# EAGLE design LAB-PLR5010D (EAGLE 6.6.0)
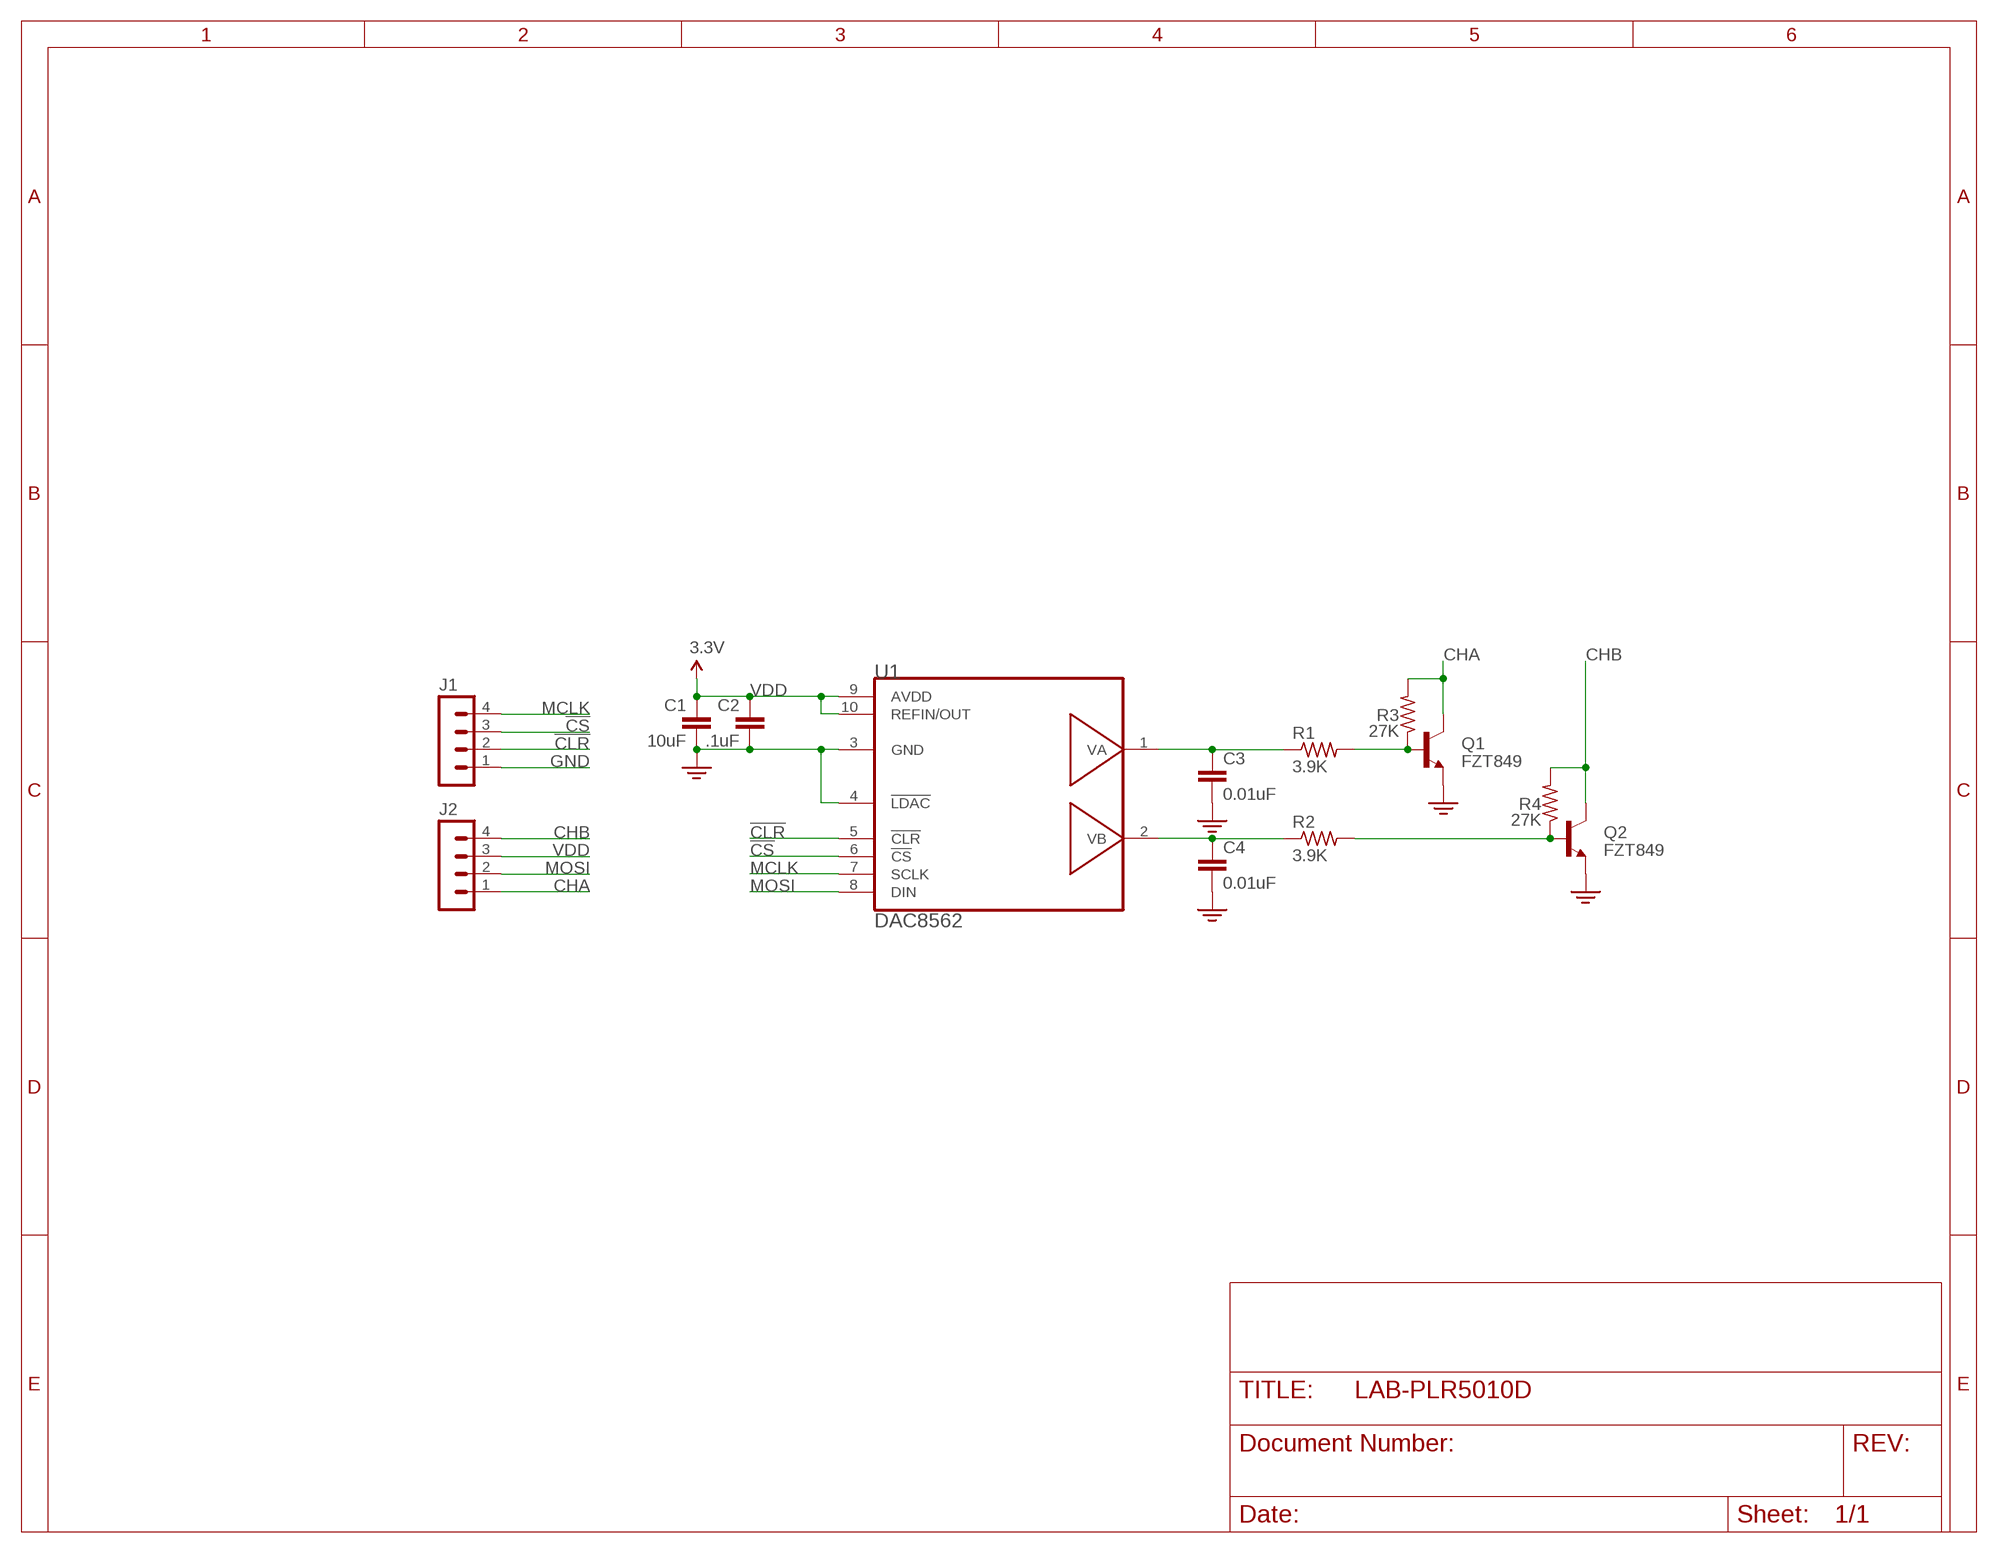
[diagram p0: schematic, sheet 1]

## Parts
C1  10uF  1NF/1000PF-50V-10%(0603)  [0603-CAP]
C2  .1uF  1NF/1000PF-50V-10%(0603)  [0603-CAP]
C3  0.01uF  1NF/1000PF-50V-10%(0603)  [0603-CAP]
C4  0.01uF  1NF/1000PF-50V-10%(0603)  [0603-CAP]
J1  MA04-1  [MA04-1]
J2  MA04-1  [MA04-1]
Q1  FZT849  [SOT223]
Q2  FZT849  [SOT223]
R1  3.9K  R-US_R0603  [R0603]
R2  3.9K  R-US_R0603  [R0603]
R3  27K  R-US_R0603  [R0603]
R4  27K  R-US_R0603  [R0603]
U1  DAC8562  [MSOP10]

## Nets
!CLR: J1.2 U1.5(!CLR)
!CS: J1.3 U1.6(!CS)
CHA: J2.1 Q1.2(C) Q1.4(C) R3.2
CHB: J2.4 Q2.2(C) Q2.4(C) R4.2
GND: C1.2 C2.2 C3.2 C4.2 J1.1 Q1.3(E) Q2.3(E) U1.3(GND) U1.4(!LDAC) ; supply symbol labelled gnd
MCLK: J1.4 U1.7(SCLK)
MOSI: J2.2 U1.8(DIN)
N$1: C3.1 R1.1 U1.1(VA)
N$3: C4.1 R2.1 U1.2(VB)
N$4: Q1.1(B) R1.2 R3.1
N$5: Q2.1(B) R2.2 R4.1
VDD: C1.1 C2.1 J2.3 U1.9(AVDD) U1.10(REFIN/OUT) ; supply symbol labelled 3.3V

## Library data of the parts
C1-C4 = SparkFun-Capacitors:1NF/1000PF-50V-10%(0603): CAP-07886; PROD_ID: CAP-07886; VALUE: 1nF
J1 J2 = con-lstb:MA04-1: PIN HEADER; OC_FARNELL: unknown; OC_NEWARK: unknown
Q1 Q2 = LAB304:FZT849
R1-R4 = rcl:R-US_: RESISTOR, American symbol
U1 = LAB-PLR5010D:DAC8562

## Board
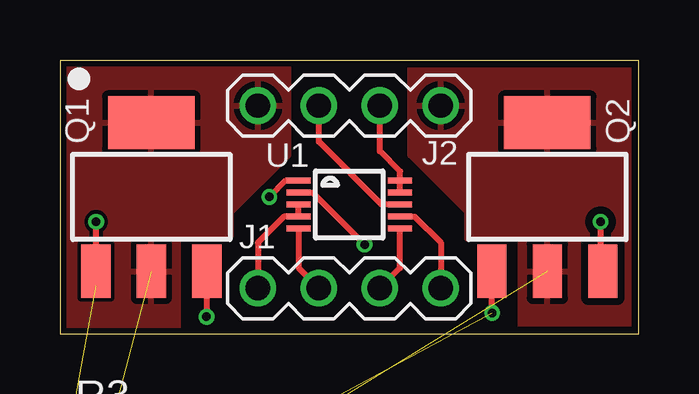
[diagram p1: board, top side]
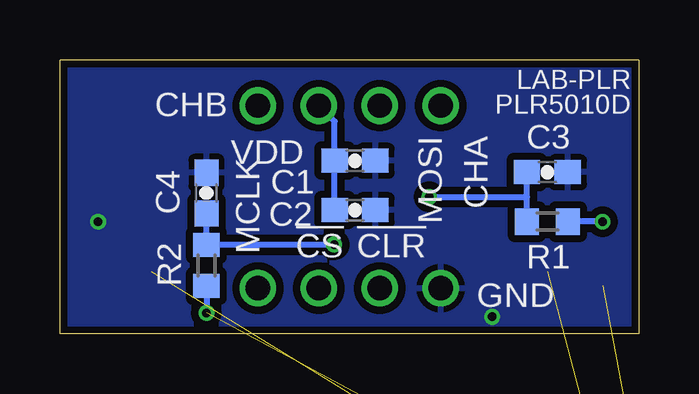
[diagram p2: board, bottom side, seen from below]

Size 24.13 x 11.43 mm. Coordinates in mm from the lower left corner, seen from the top.
Outline: 0,0 24.13,0 24.13,11.43 0,11.43 0,0
Copper layers (1*16): Top 0.035mm / dielectric 1.5mm / Bottom 0.035mm
Design rules "SeeedStudio_2layer_DRU_no_angle_20140221": minimum track width 6mil, minimum drill 12mil, track to track 6mil, track to pad 6mil, pad to pad 6mil, via to via 6mil, smd to smd 0mil, copper to edge 10mil, drill to drill 10mil, minimum pad ring 10mil, minimum via ring 6mil, stop-mask expansion 2mil, vias tented up to drill 100mil, thermal gap 10mil

### Footprints (pad centres in the part's own frame; a part is rotated, then mirrored left to right if it is on the bottom)
0603-CAP = smd 1.1 x 1: 1 -0.85,0; 2 0.85,0
MA04-1 = drill 1.016: 1 -3.81,0; 2 -1.27,0; 3 1.27,0; 4 3.81,0
SOT223 = smd 1.219 x 2.235: 1 -2.311,-3.099; 2 0,-3.099; 3 2.311,-3.099 | smd 3.6 x 2.2: 4 0,3.099
R0603 = smd 1 x 1.1: 1 -0.85,0; 2 0.85,0
MSOP10 = smd 0.25 x 1: 1 -1,-2.113; 2 -0.5,-2.113; 3 0,-2.113; 4 0.5,-2.113; 5 1,-2.113; 6 1,2.113; 7 0.5,2.113; 8 0,2.113; 9 -0.5,2.113; 10 -1,2.113

### Placement (x,y rotation side)
C1  11.83,7.22 0 bottom
C2  11.83,5.16 0 bottom
C3  3.81,6.75 0 bottom
C4  18.02,5.87 90 bottom
J1  12.06,1.91 0 top
J2  12.06,9.53 0 top
Q1  3.81,5.71 0 top
Q2  20.32,5.71 0 top
R1  3.81,4.68 0 bottom
R2  18.02,2.86 270 bottom
R3  1.27,-3.81 0 top  (outside the outline)
R4  1.27,-8.57 0 top  (outside the outline)
U1  12.06,5.4 270 top

### Tracks (layer width: path | path; a pad name or v marks a point on that pad's centre or on a via)
!CLR
  Top 0.254: U1.5 9.95,2.75 J1.2
!CS
  Top 0.254: J1.3 14.18,2.75 U1.6
CHA  (1 unrouted)
  pour Top: 9.53,11.43 0,11.43 0,0 4.92,0 4.92,4.13 7.14,4.13 7.14,5.08 9.53,7.46
CHB  (1 unrouted)
  pour Top (isolate 0.305): 14.61,11.43 24.13,11.43 24.13,0 19.21,0 19.21,3.97 16.99,3.97 16.99,5.08 14.61,7.46
GND  (via drill 0.36)
  Top 0.254: 22.62,2.93 22.54,2.86 | 22.54,2.86 22.54,2.62 Q2.3 | 22.54,2.86 v22.54,4.68 | v6.11,0.71 6.11,2.61 Q1.3 6.12,2.79 | U1.3 U1.4 9.34,4.9 8.26,3.81 J1.1
  pour Bottom (isolate 0.305): 24.13,0 24.13,11.43 0,11.43 0,0
MCLK
  Top 0.254: J1.4 15.88,3.81 14.79,4.9 U1.7
MOSI
  Top 0.254: J2.2 10.79,8.02 13.41,5.4 U1.8
N$1  (via drill 0.36)
  Top 0.254: U1.1 9.41,6.4 v8.73,5.71
  Bottom 0.254: R1.1 4.66,5.71 | 4.66,5.71 C3.1 | v8.73,5.71 4.66,5.71
N$3  (via drill 0.36)
  Top 0.254: v12.7,3.73 10.53,5.9 U1.2
  Bottom 0.254: v12.7,3.73 12.72,3.71 R2.1 C4.1
N$4  (via drill 0.36)  (1 unrouted)
  Top 0.254: Q1.1 1.5,1.99 1.51,2 v1.51,4.68
  Bottom 0.254: v1.51,4.68 R1.2
N$5  (via drill 0.36)  (1 unrouted)
  Top 0.254: v18.02,0.87 18.01,0.88 Q2.1
  Bottom 0.254: R2.2 v18.02,0.87
VDD
  Top 0.254: U1.10 U1.9 14.18,6.78 13.34,7.62 J2.3
  Bottom 0.254: 13.36,9.5 J2.3 12.68,8.87 C1.1 C2.1

### Text on the board
bNames: LAB-PLR | PLR5010D | CHB | CHA | MOSI | VDD | !CLR | !CS | MCLK | GND